# Altium schematic sheet Power.SchDoc: PDN (LDO / CCs / ESD)
size A4; Date: 21.09.2023; ApprovedBy: Prof. Dr. Jens Anders; CheckedBy: M.Sc. Tobias Wirth; Author: M.Sc. Tobias Wirth; CompanyName: IIS; DrawnBy: M.Sc. Tobias Wirth; Engineer: M.Sc. Tobias Wirth; Organization: University of Stuttgart; Address1: Pfaffenwaldring 47; Address2: 70569 Stuttgart; Revision: V1.2; SheetNumber: 2; SheetTotal: 3; ProjectNameAlt: AUS - NMR System; Time: 15:03; ImagePath: N/A; Application_BuildNumber: N/A
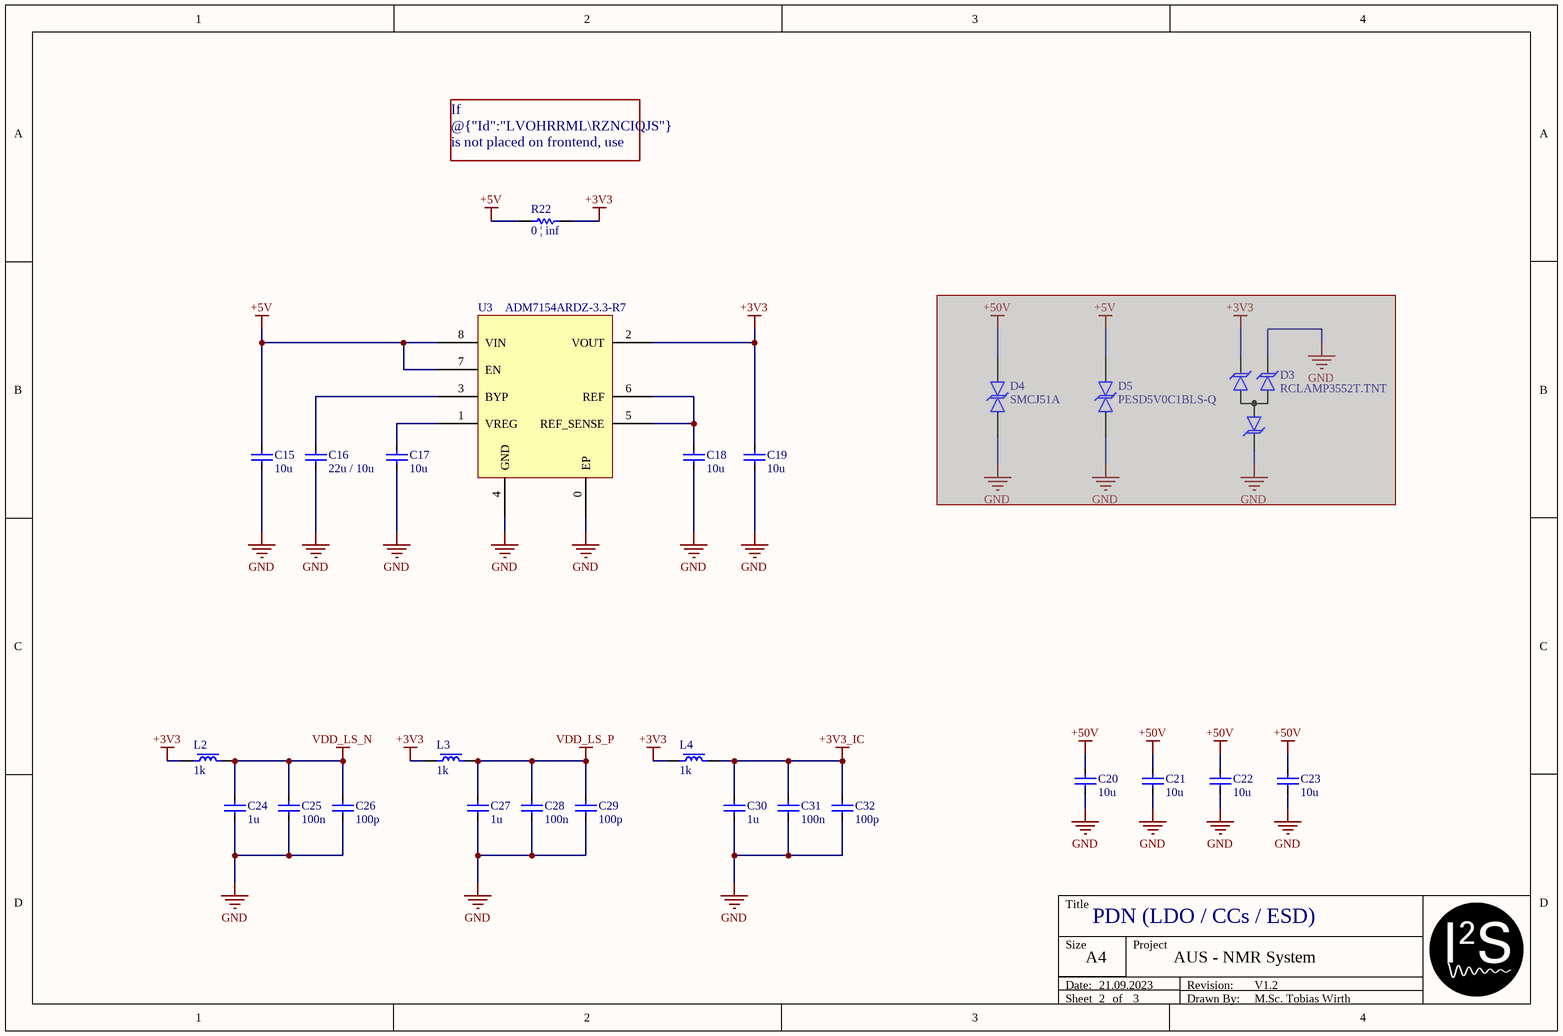
[diagram p0: Power.SchDoc]

## Parts
C15  10u  [CAP_0603]
C16  22u / 10u  [CAP_0603]
C17  10u  [CAP_0603]
C18  10u  [CAP_0603]
C19  10u  [CAP_0603]
C20  10u  [CAP_0805]
C21  10u  [CAP_0805]
C22  10u  [CAP_0805]
C23  10u  [CAP_0805]
C24  1u  [CAP_0402]
C25  100n  [CAP_0402]
C26  100p  [CAP_0402]
C27  1u  [CAP_0402]
C28  100n  [CAP_0402]
C29  100p  [CAP_0402]
C30  1u  [CAP_0402]
C31  100n  [CAP_0402]
C32  100p  [CAP_0402]
D3  RCLAMP3552T.TNT  [DFN45P60X43-3L]  (masked out: inside a compile mask, not in the netlist)
D4  SMCJ51A  [SON680P690X262-2N]  (masked out: inside a compile mask, not in the netlist)
D5  PESD5V0C1BLS-Q  [RES_0402]  (masked out: inside a compile mask, not in the netlist)
L2  1k  [CAP_0402]
L3  1k  [CAP_0402]
L4  1k  [CAP_0402]
R22  0 | inf  [RES_0402]
U3  ADM7154ARDZ-3.3-R7  [SOIC-8_TP]

## Nets
+3V3: C19.1 L2.1 L3.1 L4.1 R22.2 U3.2(VOUT)
+3V3_IC: C30.1 C31.1 C32.1 L4.2
+5V: C15.1 R22.1 U3.7(EN) U3.8(VIN)
+50V: C20.1 C21.1 C22.1 C23.1
GND: C15.2 C16.2 C17.2 C18.2 C19.2 C20.2 C21.2 C22.2 C23.2 C24.2 C25.2 C26.2 C27.2 C28.2 C29.2 C30.2 C31.2 C32.2 U3.0(EP) U3.4(GND)
VDD_LS_N: C24.1 C25.1 C26.1 L2.2
VDD_LS_P: C27.1 C28.1 C29.1 L3.2
NetC16_1: C16.1 U3.3(BYP)
NetC17_1: C17.1 U3.1(VREG)
NetC18_1: C18.1 U3.5(REF_SENSE) U3.6(REF)

## Notes on the sheet
- If @{"Id":"LVOHRRML\RZNCIQJS"} is not placed on frontend, use @{"Id":"LVOHRRML\GEZNSQGU"} to bridge the +5V and +3V3 nets
- Title
- Size
- Date:
- Sheet
- A4
- of
- Project
- Drawn By:
- Revision:

## Library data of the parts
C15-C32 = Cap: Supplier: *; Part Number: *
  C15 C17-C23: Value: 10u
  C16: Value: 22u / 10u
  C24 C27 C30: Value: 1u
  C25 C28 C31: Value: 100n
  C26 C29 C32: Value: 100p
D3 = TSV Diode 2 Channel
D4 D5 = TSV Diode Bidirectional
L2-L4 = FerriteBead: Part Number: *; Supplier: *; Value: 1k
R22 = Res: Part Number: *; Supplier: *; Value: 0 | inf
U3 = ADM715X